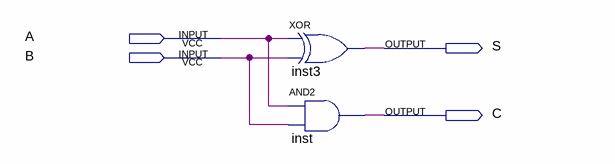
[diagram p0: schematic sheet]
// Quartus schematic obha.bdf as structural Verilog: 2 symbols, 4 pins
module obha (
  input  A,
  input  B,
  output S,
  output C
);

  xor inst3 (S, A, B);
  and inst (C, A, B);
endmodule
